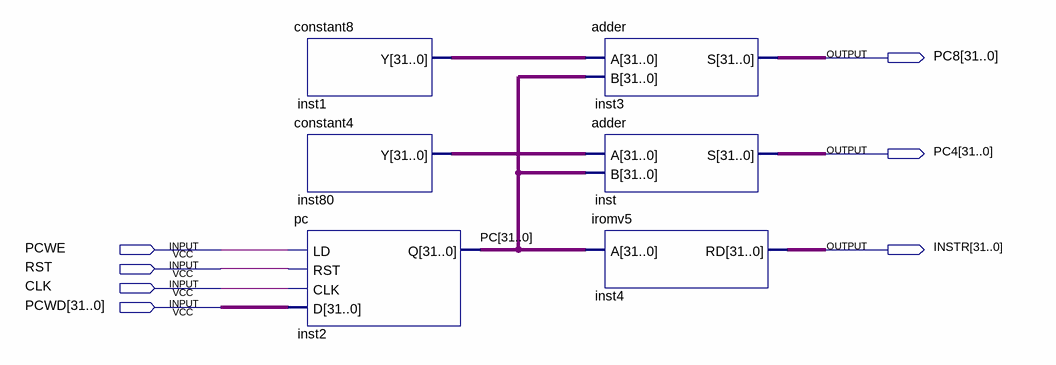
[diagram p0: schematic sheet]
// Quartus schematic fetch.bdf as structural Verilog: 6 symbols, 7 pins
module fetch (
  input  PCWE,
  input  RST,
  input  CLK,
  input  [31:0] PCWD,
  output [31:0] PC8,
  output [31:0] PC4,
  output [31:0] INSTR
);

  wire [31:0] inst1_y, inst80_y, PC;

  constant8 inst1 (.Y(inst1_y));
  constant4 inst80 (.Y(inst80_y));
  pc inst2 (.LD(PCWE), .RST(RST), .CLK(CLK), .D(PCWD), .Q(PC));
  adder inst3 (.A(inst1_y), .B(PC), .S(PC8));
  adder inst (.A(inst80_y), .B(PC), .S(PC4));
  iromv5 inst4 (.A(PC), .RD(INSTR));
endmodule
